# Altium schematic sheet Main.SchDoc
size B; SheetNumber: 1; SheetTotal: 15
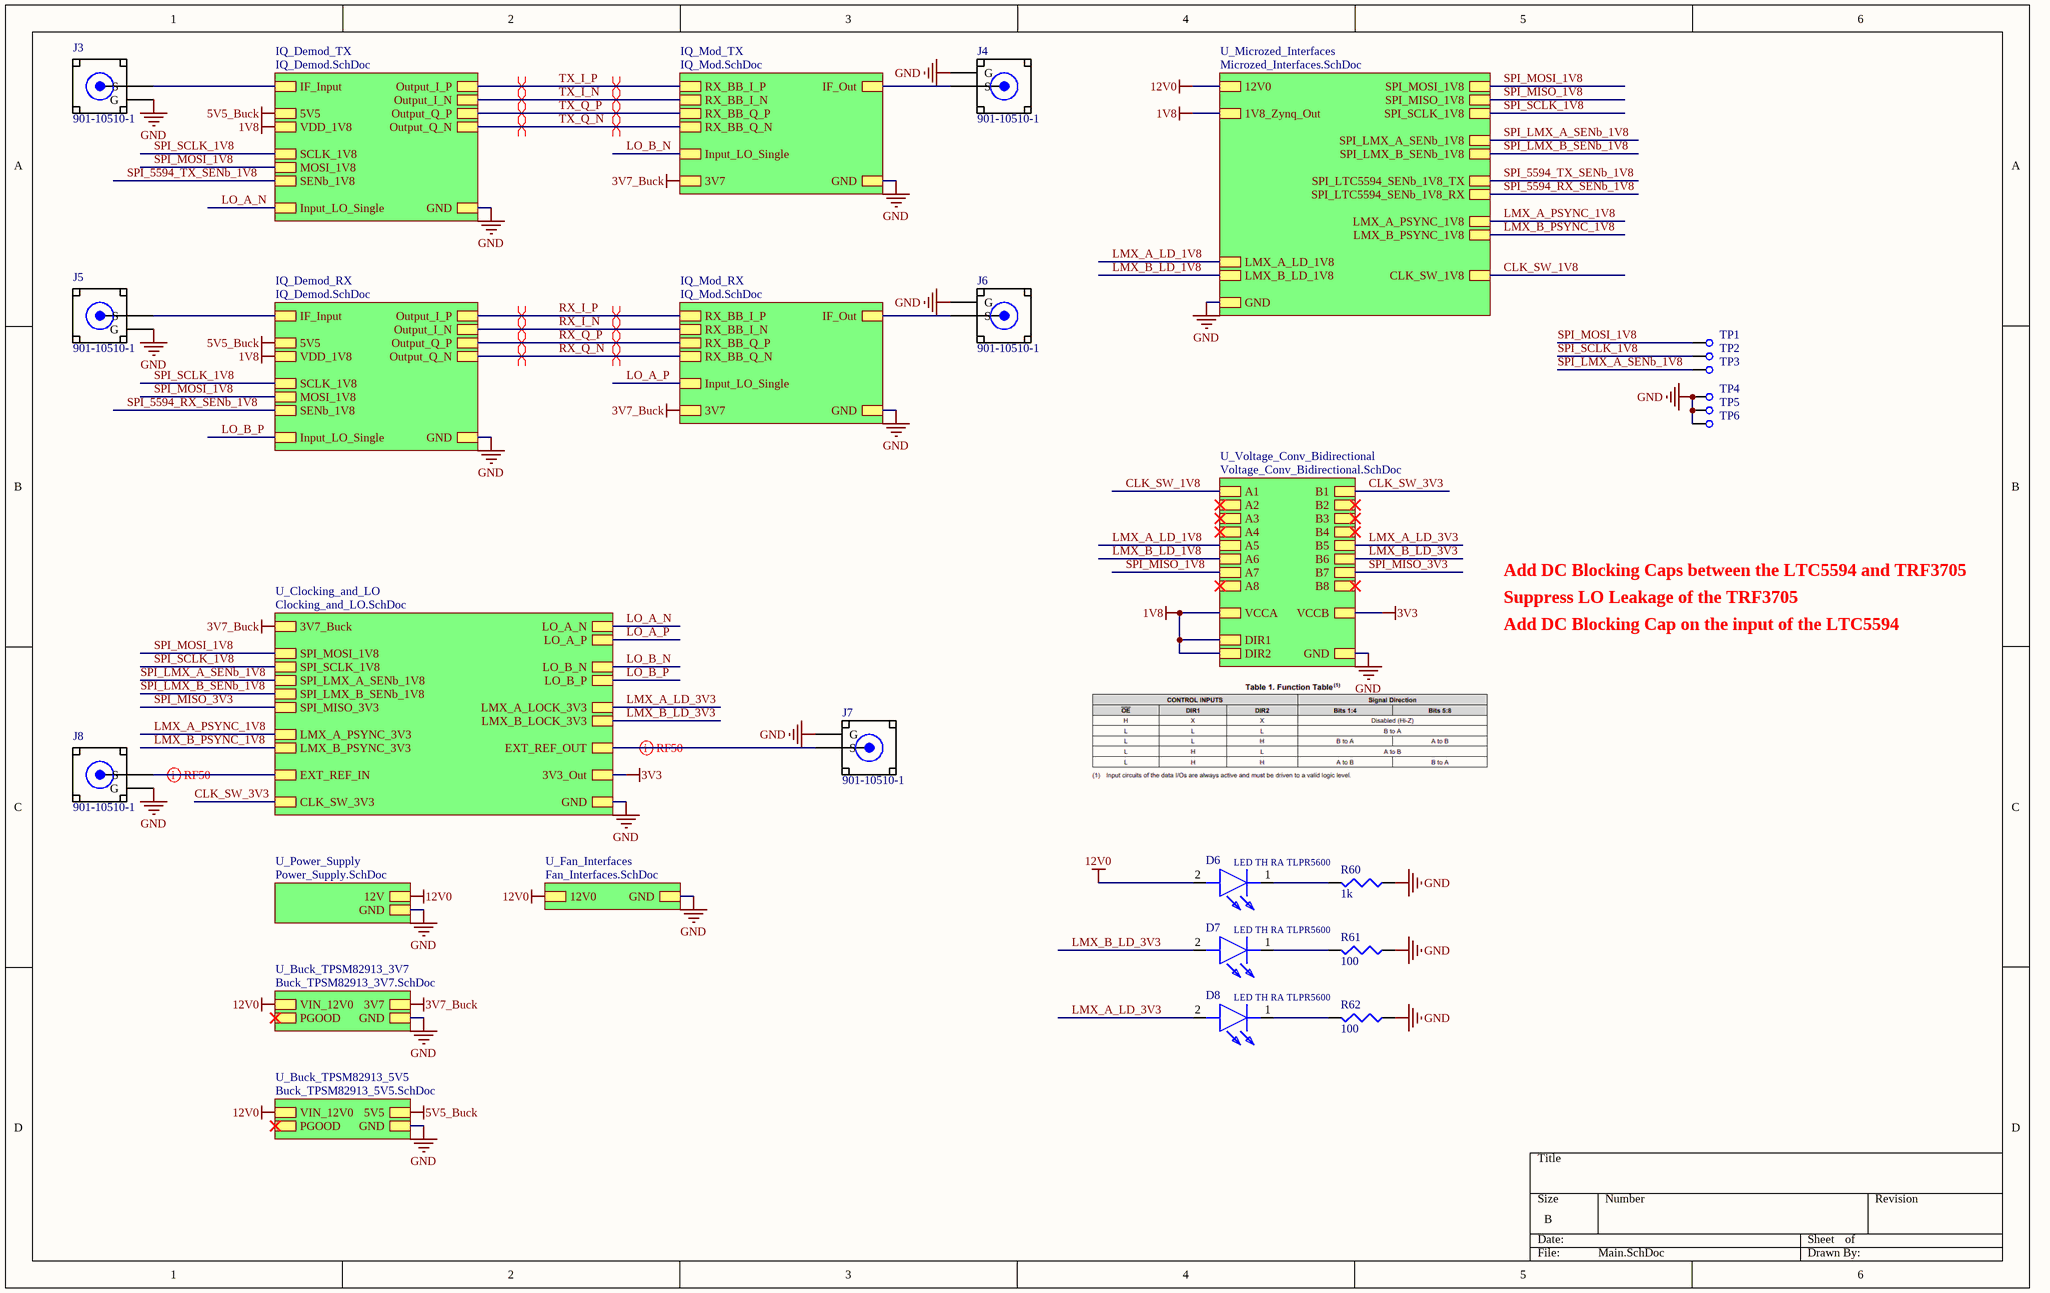
[diagram p0: Main.SchDoc]

## Parts
D6  LED TH RA TLPR5600  [LED TH RA TLPP5600]
D7  LED TH RA TLPR5600  [LED TH RA TLPP5600]
D8  LED TH RA TLPR5600  [LED TH RA TLPP5600]
J3  901-10510-1  [Amphenol RF 901-10510-1 - 8.8mil GCPW]
J4  901-10510-1  [Amphenol RF 901-10510-1 - 8.8mil GCPW]
J5  901-10510-1  [Amphenol RF 901-10510-1 - 8.8mil GCPW]
J6  901-10510-1  [Amphenol RF 901-10510-1 - 8.8mil GCPW]
J7  901-10510-1  [Amphenol RF 901-10510-1 - 8.8mil GCPW]
J8  901-10510-1  [Amphenol RF 901-10510-1 - 8.8mil GCPW]
R60  1k  [SMD-0402]
R61  100  [SMD-0402]
R62  100  [SMD-0402]
TP1  Keystone 5004  [Keystone 5004 Testpoint]  (value not drawn)
TP2  Keystone 5004  [Keystone 5004 Testpoint]  (value not drawn)
TP3  Keystone 5004  [Keystone 5004 Testpoint]  (value not drawn)
TP4  Keystone 5004  [Keystone 5004 Testpoint]  (value not drawn)
TP5  Keystone 5004  [Keystone 5004 Testpoint]  (value not drawn)
TP6  Keystone 5004  [Keystone 5004 Testpoint]  (value not drawn)

## Sub-sheets
IQ_Demod_RX = IQ_Demod.SchDoc: Input_LO_Single, GND, 5V5, VDD_1V8, IF_Input, SCLK_1V8, MOSI_1V8, SENb_1V8, Output_I_P, Output_I_N, Output_Q_N, Output_Q_P
IQ_Demod_TX = IQ_Demod.SchDoc: Input_LO_Single, GND, 5V5, VDD_1V8, IF_Input, SCLK_1V8, MOSI_1V8, SENb_1V8, Output_I_P, Output_I_N, Output_Q_N, Output_Q_P
IQ_Mod_RX = IQ_Mod.SchDoc: 3V7, GND, Input_LO_Single, RX_BB_I_N, RX_BB_I_P, RX_BB_Q_N, RX_BB_Q_P, IF_Out
IQ_Mod_TX = IQ_Mod.SchDoc: 3V7, GND, Input_LO_Single, RX_BB_I_N, RX_BB_I_P, RX_BB_Q_N, RX_BB_Q_P, IF_Out
U_Buck_TPSM82913_3V7 = Buck_TPSM82913_3V7.SchDoc: GND, VIN_12V0, PGOOD, 3V7
U_Buck_TPSM82913_5V5 = Buck_TPSM82913_5V5.SchDoc: GND, VIN_12V0, PGOOD, 5V5
U_Clocking_and_LO = Clocking_and_LO.SchDoc: 3V7_Buck, GND, SPI_MOSI_1V8, SPI_SCLK_1V8, SPI_LMX_A_SENb_1V8, SPI_MISO_3V3, SPI_LMX_B_SENb_1V8, LMX_B_PSYNC_3V3, LMX_A_LOCK_3V3, LMX_B_LOCK_3V3, LO_B_N, LO_B_P, EXT_REF_OUT, LMX_A_PSYNC_3V3, LO_A_N, LO_A_P, EXT_REF_IN, CLK_SW_3V3, 3V3_Out
U_Fan_Interfaces = Fan_Interfaces.SchDoc: 12V0, GND
U_Microzed_Interfaces = Microzed_Interfaces.SchDoc: 12V0, GND, CLK_SW_1V8, LMX_B_PSYNC_1V8, LMX_A_LD_1V8, LMX_B_LD_1V8, SPI_MISO_1V8, SPI_SCLK_1V8, SPI_MOSI_1V8, SPI_LMX_A_SENb_1V8, SPI_LMX_B_SENb_1V8, SPI_LTC5594_SENb_1V8_TX, SPI_LTC5594_SENb_1V8_RX, LMX_A_PSYNC_1V8, 1V8_Zynq_Out
U_Power_Supply = Power_Supply.SchDoc: 12V, GND
U_Voltage_Conv_Bidirectional = Voltage_Conv_Bidirectional.SchDoc: VCCA, VCCB, A1, DIR1, DIR2, A2, A3, A4, A5, A6, A7, A8, B1, B2, B3, B4, B5, B6, B7, B8, GND

## Nets
1V8: sheet IQ_Demod_TX/VDD_1V8, sheet IQ_Demod_RX/VDD_1V8, sheet U_Microzed_Interfaces/1V8_Zynq_Out, sheet U_Voltage_Conv_Bidirectional/VCCA, sheet U_Voltage_Conv_Bidirectional/DIR1, sheet U_Voltage_Conv_Bidirectional/DIR2
3V3: sheet U_Clocking_and_LO/3V3_Out, sheet U_Voltage_Conv_Bidirectional/VCCB
3V7_Buck: sheet IQ_Mod_TX/3V7, sheet IQ_Mod_RX/3V7, sheet U_Clocking_and_LO/3V7_Buck, sheet U_Buck_TPSM82913_3V7/3V7
5V5_Buck: sheet IQ_Demod_TX/5V5, sheet IQ_Demod_RX/5V5, sheet U_Buck_TPSM82913_5V5/5V5
12V0: D6.2(A) ; sheet U_Power_Supply/12V, sheet U_Microzed_Interfaces/12V0, sheet U_Buck_TPSM82913_3V7/VIN_12V0, sheet U_Buck_TPSM82913_5V5/VIN_12V0, sheet U_Fan_Interfaces/12V0
GND: J3.G J4.G J5.G J6.G J7.G J8.G R60.1 R61.1 R62.1 TP4.1 TP5.1 TP6.1 ; sheet IQ_Mod_TX/GND, sheet IQ_Demod_TX/GND, sheet IQ_Mod_RX/GND, sheet IQ_Demod_RX/GND, sheet U_Clocking_and_LO/GND, sheet U_Power_Supply/GND, sheet U_Microzed_Interfaces/GND, sheet U_Buck_TPSM82913_3V7/GND, sheet U_Buck_TPSM82913_5V5/GND, sheet U_Voltage_Conv_Bidirectional/GND, sheet U_Fan_Interfaces/GND
CLK_SW_1V8: sheet U_Microzed_Interfaces/CLK_SW_1V8, sheet U_Voltage_Conv_Bidirectional/A1
CLK_SW_3V3: sheet U_Clocking_and_LO/CLK_SW_3V3, sheet U_Voltage_Conv_Bidirectional/B1
LMX_A_LD_1V8: sheet U_Microzed_Interfaces/LMX_A_LD_1V8, sheet U_Voltage_Conv_Bidirectional/A5
LMX_A_LD_3V3: D8.2(A) ; sheet U_Clocking_and_LO/LMX_A_LOCK_3V3, sheet U_Voltage_Conv_Bidirectional/B5
LMX_A_PSYNC_1V8: sheet U_Clocking_and_LO/LMX_A_PSYNC_3V3, sheet U_Microzed_Interfaces/LMX_A_PSYNC_1V8
LMX_B_LD_1V8: sheet U_Microzed_Interfaces/LMX_B_LD_1V8, sheet U_Voltage_Conv_Bidirectional/A6
LMX_B_LD_3V3: D7.2(A) ; sheet U_Clocking_and_LO/LMX_B_LOCK_3V3, sheet U_Voltage_Conv_Bidirectional/B6
LMX_B_PSYNC_1V8: sheet U_Clocking_and_LO/LMX_B_PSYNC_3V3, sheet U_Microzed_Interfaces/LMX_B_PSYNC_1V8
LO_A_N: sheet IQ_Demod_TX/Input_LO_Single, sheet U_Clocking_and_LO/LO_A_N
LO_A_P: sheet IQ_Mod_RX/Input_LO_Single, sheet U_Clocking_and_LO/LO_A_P
LO_B_N: sheet IQ_Mod_TX/Input_LO_Single, sheet U_Clocking_and_LO/LO_B_N
LO_B_P: sheet IQ_Demod_RX/Input_LO_Single, sheet U_Clocking_and_LO/LO_B_P
RX_I_N: sheet IQ_Mod_RX/RX_BB_I_N, sheet IQ_Demod_RX/Output_I_N
RX_I_P: sheet IQ_Mod_RX/RX_BB_I_P, sheet IQ_Demod_RX/Output_I_P
RX_Q_N: sheet IQ_Mod_RX/RX_BB_Q_N, sheet IQ_Demod_RX/Output_Q_N
RX_Q_P: sheet IQ_Mod_RX/RX_BB_Q_P, sheet IQ_Demod_RX/Output_Q_P
SPI_5594_RX_SENb_1V8: sheet IQ_Demod_RX/SENb_1V8, sheet U_Microzed_Interfaces/SPI_LTC5594_SENb_1V8_RX
SPI_5594_TX_SENb_1V8: sheet IQ_Demod_TX/SENb_1V8, sheet U_Microzed_Interfaces/SPI_LTC5594_SENb_1V8_TX
SPI_LMX_A_SENb_1V8: TP3.1 ; sheet U_Clocking_and_LO/SPI_LMX_A_SENb_1V8, sheet U_Microzed_Interfaces/SPI_LMX_A_SENb_1V8
SPI_LMX_B_SENb_1V8: sheet U_Clocking_and_LO/SPI_LMX_B_SENb_1V8, sheet U_Microzed_Interfaces/SPI_LMX_B_SENb_1V8
SPI_MISO_1V8: sheet U_Microzed_Interfaces/SPI_MISO_1V8, sheet U_Voltage_Conv_Bidirectional/A7
SPI_MISO_3V3: sheet U_Clocking_and_LO/SPI_MISO_3V3, sheet U_Voltage_Conv_Bidirectional/B7
SPI_MOSI_1V8: TP1.1 ; sheet IQ_Demod_TX/MOSI_1V8, sheet IQ_Demod_RX/MOSI_1V8, sheet U_Clocking_and_LO/SPI_MOSI_1V8, sheet U_Microzed_Interfaces/SPI_MOSI_1V8
SPI_SCLK_1V8: TP2.1 ; sheet IQ_Demod_TX/SCLK_1V8, sheet IQ_Demod_RX/SCLK_1V8, sheet U_Clocking_and_LO/SPI_SCLK_1V8, sheet U_Microzed_Interfaces/SPI_SCLK_1V8
TX_I_N: sheet IQ_Mod_TX/RX_BB_I_N, sheet IQ_Demod_TX/Output_I_N
TX_I_P: sheet IQ_Mod_TX/RX_BB_I_P, sheet IQ_Demod_TX/Output_I_P
TX_Q_N: sheet IQ_Mod_TX/RX_BB_Q_N, sheet IQ_Demod_TX/Output_Q_N
TX_Q_P: sheet IQ_Mod_TX/RX_BB_Q_P, sheet IQ_Demod_TX/Output_Q_P
NetD6_1: D6.1(K) R60.2
NetD7_1: D7.1(K) R61.2
NetD8_1: D8.1(K) R62.2
NetJ3_S: J3.S ; sheet IQ_Demod_TX/IF_Input
NetJ4_S: J4.S ; sheet IQ_Mod_TX/IF_Out
NetJ5_S: J5.S ; sheet IQ_Demod_RX/IF_Input
NetJ6_S: J6.S ; sheet IQ_Mod_RX/IF_Out
NetJ7_S: J7.S ; sheet U_Clocking_and_LO/EXT_REF_OUT
NetJ8_S: J8.S ; sheet U_Clocking_and_LO/EXT_REF_IN

## Layout directives
differential pair: RX_I_N, RX_I_P, RX_Q_N, RX_Q_P, TX_I_N, TX_I_P, TX_Q_N, TX_Q_P
net class RF50: NetJ7_S, NetJ8_S
net class DIFF_100: RX_I_N, RX_I_P, RX_Q_N, RX_Q_P, TX_I_N, TX_I_P, TX_Q_N, TX_Q_P

## Notes on the sheet
- Add DC Blocking Caps between the LTC5594 and TRF3705
- Suppress LO Leakage of the TRF3705
- Add DC Blocking Cap on the input of the LTC5594

## Library data of the parts
D6-D8 = LED TH RA TLPR5600: LED Through Hole, Right Angle; Manufacturer_Name: Vishay; Datasheet Link: https://www.vishay.com/docs/83043/tlpg5600.pdf; Manufacturer_Part_Number: TLPR5600; Mouser Part Number: 78-TLPR5600; Mouser Price/Stock: https://www.mouser.co.uk/ProductDetail/Vishay-Semiconductors/TLPR5600?qs=RzxYCzJDjPV97gjcooV9KQ%3D%3D; Arrow Part Number: TLPR5600; Arrow Price/Stock: https://www.arrow.com/en/products/tlpr5600/vishay?region=nac
J3-J8 = Amphenol 901-10510-1: SMA Connector Jack, Female Socket 50 Ohms Board Edge, End Launch; Through Hole, Right Angle Solder (Square Flange); MF: Samtec; MP: SMA-J-P-H-ST-EM1; Price: None; SnapEDA_Link: https://www.snapeda.com/parts/SMA-J-P-H-ST-EM1/Samtec%20Inc./view-part/?ref=snap; Package: None; Availability: Unavailable; Value: *
R60-R62 = RES0402: Resistor-0402
TP1-TP6 = Keystone_TP_5000_Series: Test point 50mil diameter